# Altium project Aux_SteeringWheel_V8.PrjPcb
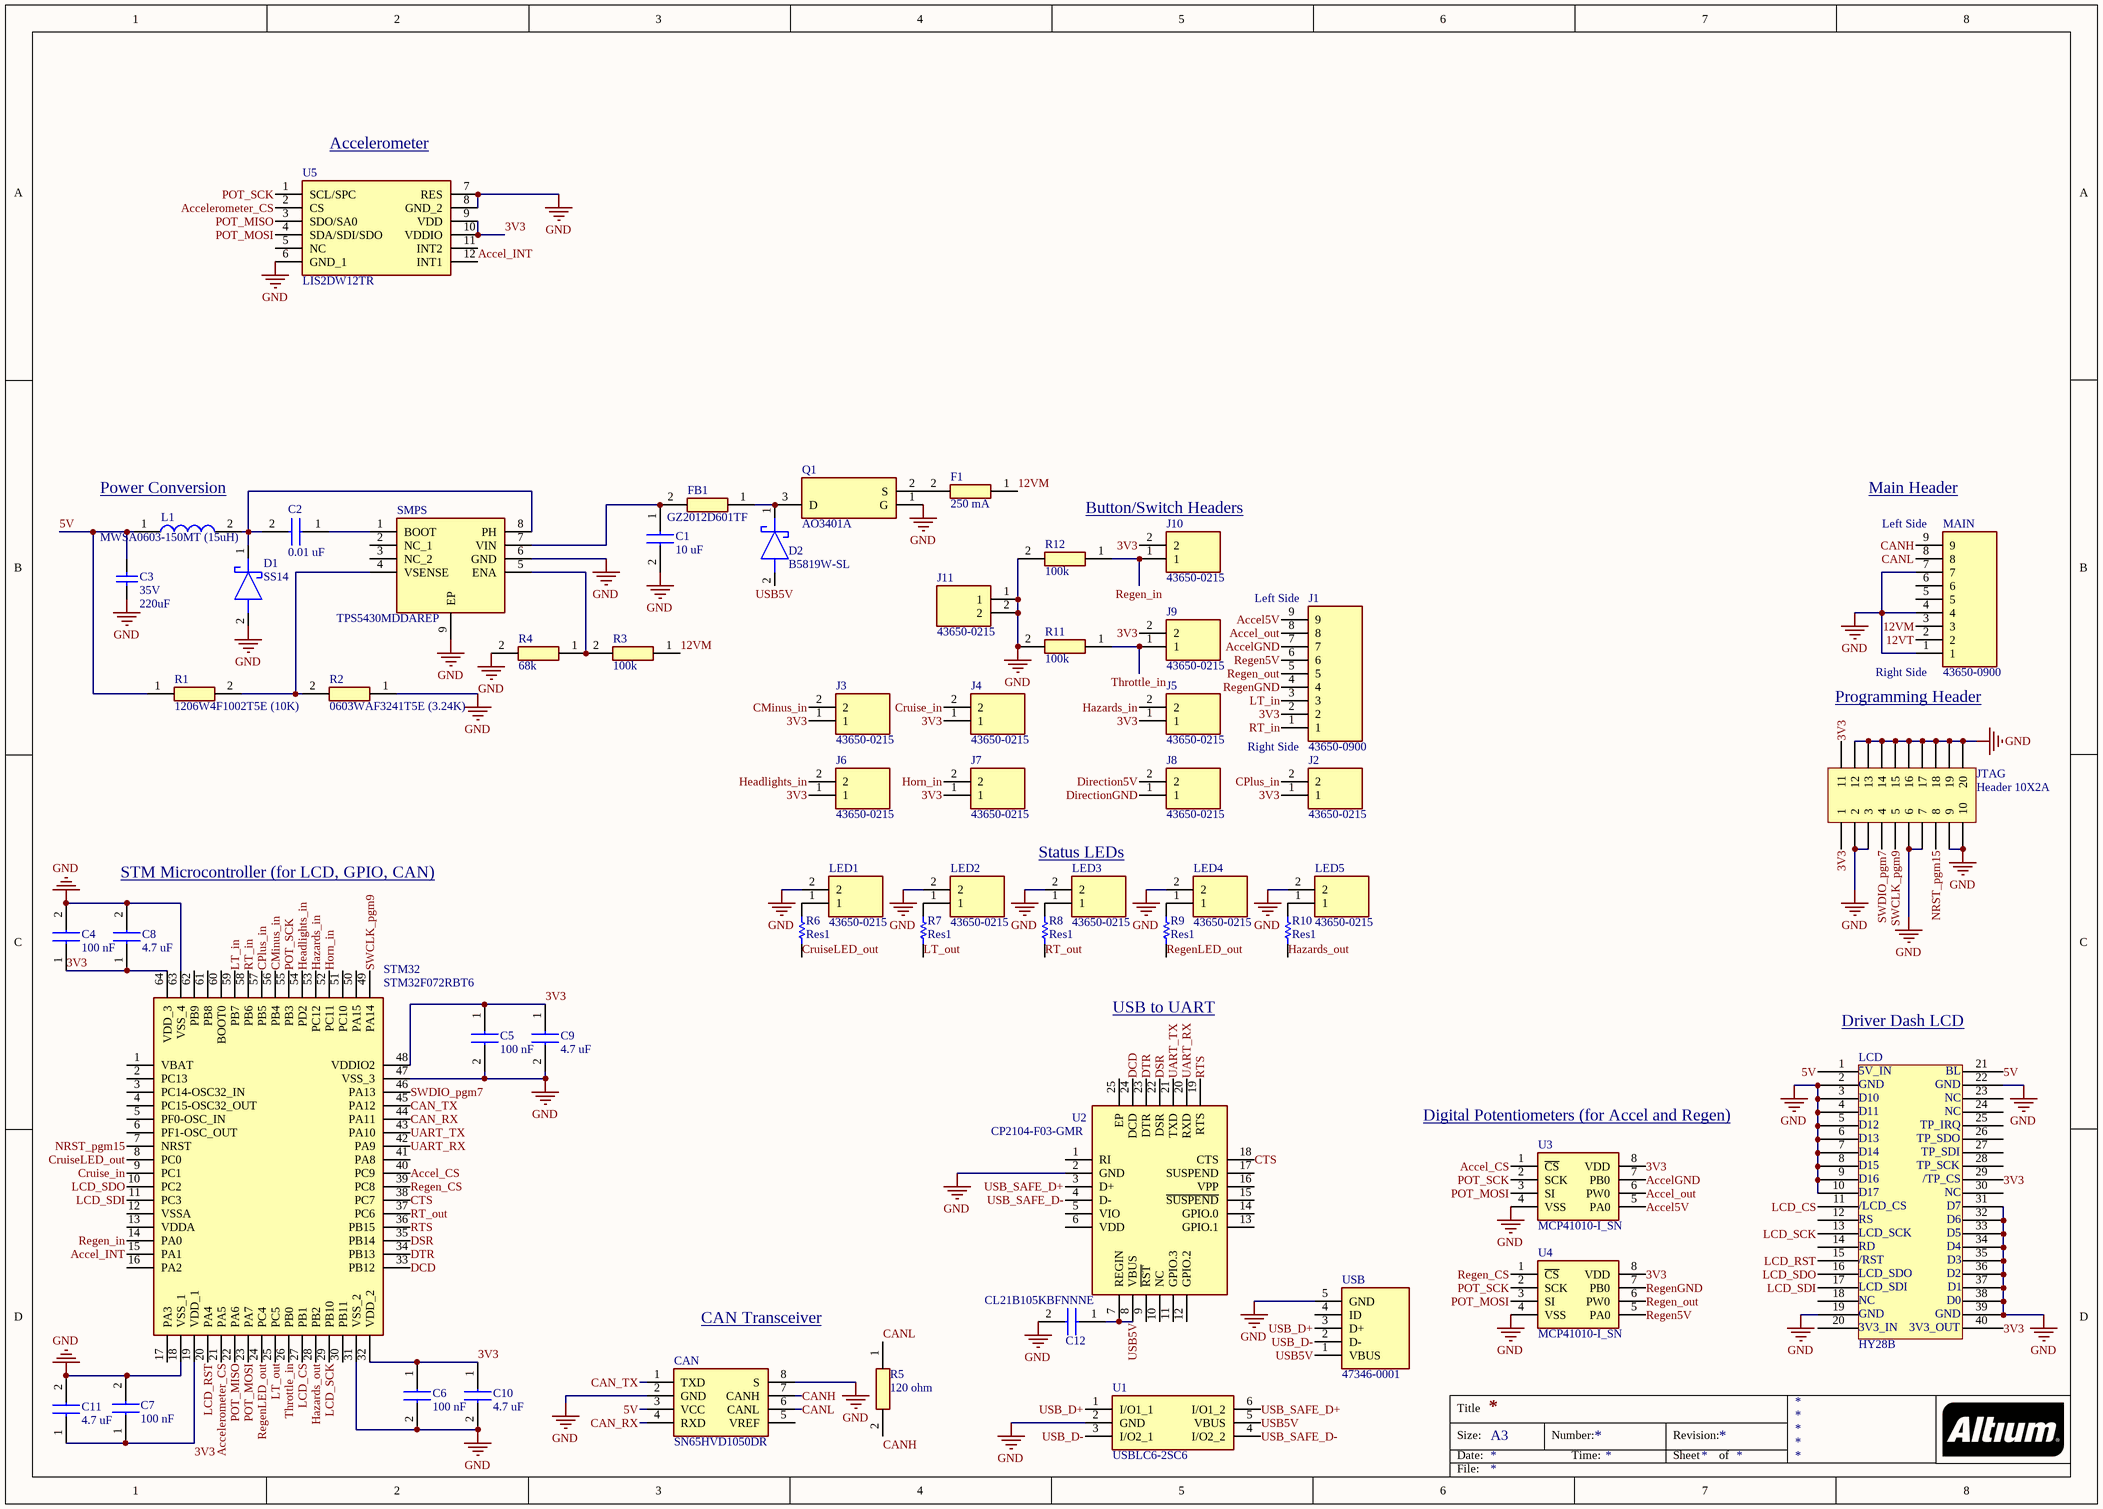
[diagram p0: Sheet4.SchDoc]
1 sheet, 58 parts. Net scope: global (net labels, ports and power ports of the same name join across sheets).
Board file: PCB1.PcbDoc

## Sheet Sheet4.SchDoc
size A3

### Parts
C1  10 uF  [CAPC2012X145N]
C2  0.01 uF  [CAPC2012X65N]
C3  35V  value 220uF  [RAD-0.3]
C4  100 nF  [CAPC1005X55N]
C5  100 nF  [CAPC1005X55N]
C6  100 nF  [CAPC1005X55N]
C7  100 nF  [CAPC1005X55N]
C8  4.7 uF  [CAPC2012X140N]
C9  4.7 uF  [CAPC2012X140N]
C10  4.7 uF  [CAPC2012X140N]
C11  4.7 uF  [CAPC2012X140N]
C12  CL21B105KBFNNNE  [CAPC2012X135N]
CAN  SN65HVD1050DR  [SOIC127P600X175-8N]
D1  SS14  [DIONM5327X242N]
D2  B5819W-SL  [SOD3716X135N]
F1  250 mA  [RESC3216X51N]
FB1  GZ2012D601TF  [RESC2012X55N]
J1  43650-0900  [436500900]
J2  43650-0215  [43650-0217]
J3  43650-0215  [43650-0217]
J4  43650-0215  [43650-0217]
J5  43650-0215  [43650-0217]
J6  43650-0215  [43650-0217]
J7  43650-0215  [43650-0217]
J8  43650-0215  [43650-0217]
J9  43650-0215  [43650-0217]
J10  43650-0215  [43650-0217]
J11  43650-0215  [43650-0217]
JTAG  Header 10X2A  [HDR2X10_CEN]
L1  MWSA0603-150MT (15uH)  [INDPM7166X300N]
LCD  HY28B  [HY28B]
LED1  43650-0215  [43650-0217]
LED2  43650-0215  [43650-0217]
LED3  43650-0215  [43650-0217]
LED4  43650-0215  [43650-0217]
LED5  43650-0215  [43650-0217]
MAIN  43650-0900  [436500900]
Q1  AO3401A  [SOT95P237X115-3N]
R1  1206W4F1002T5E (10K)  [RESC3216X75N]
R2  0603WAF3241T5E (3.24K)  [RESC1608X55N]
R3  100k  [RESC3216X51N]
R4  68k  [RESC1608X55N]
R5  120 ohm  [RESC1608X55N]
R6  Res1  [AXIAL-0.3]
R7  Res1  [AXIAL-0.3]
R8  Res1  [AXIAL-0.3]
R9  Res1  [AXIAL-0.3]
R10  Res1  [AXIAL-0.3]
R11  100k  [RESC3216X51N]
R12  100k  [RESC3216X51N]
SMPS  TPS5430MDDAREP  [SOIC127P600X170-9N]
STM32  STM32F072RBT6  [QFP50P1200X1200X160-64N]
U1  USBLC6-2SC6  [SOT95P280X145-6N]
U2  CP2104-F03-GMR  [QFN50P400X400X80-25N-D]
U3  MCP41010-I_SN  [SOIC127P600X175-8N]
U4  MCP41010-I_SN  [SOIC127P600X175-8N]
U5  LIS2DW12TR  [LGA-12]
USB  47346-0001  [47346-0001]

### Nets
GND: C1.2 C3.1 C4.2 C5.2 C6.2 C7.2 C8.2 C9.2 C10.2 C11.2 C12.2 CAN.2(GND) CAN.8(S) D1.2(A) J11.1 J11.2 JTAG.2 JTAG.3 JTAG.6 JTAG.7 JTAG.9 JTAG.10 JTAG.12 JTAG.13 JTAG.14 JTAG.15 JTAG.16 JTAG.17 JTAG.18 JTAG.19 JTAG.20 LCD.2 LCD.3 LCD.4 LCD.5 LCD.6 LCD.7 LCD.8 LCD.9 LCD.10 LCD.19 LCD.22 LCD.31 LCD.32 LCD.33 LCD.34 LCD.35 LCD.36 LCD.37 LCD.38 LCD.39 LED1.2 LED2.2 LED3.2 LED4.2 LED5.2 MAIN.1 MAIN.4 MAIN.7 Q1.1(G) R2.1 R4.2 R11.2 R12.2 SMPS.6(GND) SMPS.9(EP) STM32.18(VSS_1) STM32.31(VSS_2) STM32.47(VSS_3) STM32.63(VSS_4) U1.2(GND) U2.2(GND) U3.4(VSS) U4.4(VSS) U5.6(GND_1) U5.7(RES) U5.8(GND_2) USB.5(GND)
3V3: C4.1 C5.1 C6.1 C7.1 C8.1 C9.1 C10.1 C11.1 J1.2 J2.1 J3.1 J4.1 J5.1 J6.1 J7.1 J9.2 J10.2 JTAG.1 JTAG.11 LCD.29 LCD.40 STM32.19(VDD_1) STM32.32(VDD_2) STM32.48(VDDIO2) STM32.64(VDD_3) U3.8(VDD) U4.8(VDD) U5.9(VDD) U5.10(VDDIO)
5V: C3.2 CAN.3(VCC) L1.1 LCD.1 LCD.21 R1.1
12VM: F1.1 MAIN.3 R3.1
12VT: MAIN.2
Accel5V: J1.9 U3.5(PA0)
Accel_CS: STM32.40(PC9) U3.1(~{CS})
Accel_INT: STM32.15(PA1) U5.12(INT1)
Accel_out: J1.8 U3.6(PW0)
Accelerometer_CS: STM32.21(PA5) U5.2(CS)
AccelGND: J1.7 U3.7(PB0)
CAN_RX: CAN.4(RXD) STM32.44(PA11)
CAN_TX: CAN.1(TXD) STM32.45(PA12)
CANH: CAN.7(CANH) MAIN.9 R5.2
CANL: CAN.6(CANL) MAIN.8 R5.1
CMinus_in: J3.2 STM32.56(PB4)
CPlus_in: J2.2 STM32.57(PB5)
Cruise_in: J4.2 STM32.9(PC1)
CruiseLED_out: R6.1 STM32.8(PC0)
CTS: STM32.38(PC7) U2.18(CTS)
DCD: STM32.33(PB12) U2.24(DCD)
Direction5V: J8.2
DirectionGND: J8.1
DSR: STM32.35(PB14) U2.22(DSR)
DTR: STM32.34(PB13) U2.23(DTR)
Hazards_in: J5.2 STM32.53(PC12)
Hazards_out: R10.1 STM32.28(PB2)
Headlights_in: J6.2 STM32.54(PD2)
Horn_in: J7.2 STM32.52(PC11)
LCD_CS: LCD.11 STM32.27(PB1)
LCD_RST: LCD.15 STM32.20(PA4)
LCD_SCK: LCD.13 STM32.29(PB10)
LCD_SDI: LCD.17 STM32.11(PC3)
LCD_SDO: LCD.16 STM32.10(PC2)
LT_in: J1.3 STM32.59(PB7)
LT_out: R7.1 STM32.25(PC5)
NRST_pgm15: JTAG.8 STM32.7(NRST)
POT_MISO: STM32.22(PA6) U5.3(SDO/SA0)
POT_MOSI: STM32.23(PA7) U3.3(SI) U4.3(SI) U5.4(SDA/SDI/SDO)
POT_SCK: STM32.55(PB3) U3.2(SCK) U4.2(SCK) U5.1(SCL/SPC)
Regen5V: J1.6 U4.5(PA0)
Regen_CS: STM32.39(PC8) U4.1(~{CS})
Regen_in: J10.1 R12.1 STM32.14(PA0)
Regen_out: J1.5 U4.6(PW0)
RegenGND: J1.4 U4.7(PB0)
RegenLED_out: R9.1 STM32.24(PC4)
RT_in: J1.1 STM32.58(PB6)
RT_out: R8.1 STM32.37(PC6)
RTS: STM32.36(PB15) U2.19(RTS)
SWCLK_pgm9: JTAG.5 STM32.49(PA14)
SWDIO_pgm7: JTAG.4 STM32.46(PA13)
Throttle_in: J9.1 R11.1 STM32.26(PB0)
UART_RX: STM32.42(PA9) U2.20(RXD)
UART_TX: STM32.43(PA10) U2.21(TXD)
USB5V: C12.1 D2.2(A) U1.5(VBUS) U2.7(REGIN) U2.8(VBUS) USB.1(VBUS)
USB_D+: U1.1(I/O1_1) USB.3(D+)
USB_D-: U1.3(I/O2_1) USB.2(D-)
USB_SAFE_D+: U1.6(I/O1_2) U2.3(D+)
USB_SAFE_D-: U1.4(I/O2_2) U2.4(D-)
NetC1_1: C1.1 FB1.2 SMPS.7(VIN)
NetC2_1: C2.1 SMPS.1(BOOT)
NetC2_2: C2.2 D1.1(K) L1.2 SMPS.8(PH)
NetD2_1: D2.1(K) FB1.1 Q1.3(D)
NetF1_2: F1.2 Q1.2(S)
NetLED1_1: LED1.1 R6.2
NetLED2_1: LED2.1 R7.2
NetLED3_1: LED3.1 R8.2
NetLED4_1: LED4.1 R9.2
NetLED5_1: LED5.1 R10.2
NetR1_2: R1.2 R2.2 SMPS.4(VSENSE)
NetR3_2: R3.2 R4.1 SMPS.5(ENA)

Not connected (* = marked no-connect by the designer): CAN 5(VREF); LCD 12 14 18 20 23 24 25 26 27 28 30; MAIN 5 6; SMPS 2(NC_1) 3(NC_2); STM32 1(VBAT) 2(PC13) 3(PC14-OSC32_IN) 4(PC15-OSC32_OUT) 5(PF0-OSC_IN) 6(PF1-OSC_OUT) 12(VSSA) 13(VDDA) 16(PA2) 17(PA3) 30(PB11) 41(PA8) 50(PA15) 51(PC10) 60(BOOT0) 61(PB8) 62(PB9); U2 1(RI) 5(VIO) 6(VDD) 9(~{RST}) 10(NC) 11(GPIO.3) 12(GPIO.2) 13(GPIO.1) 14(GPIO.0) 15(~{SUSPEND}) 16(VPP) 17(SUSPEND) 25(EP); U5 5(NC) 11(INT2); USB 4(ID)

### Notes on the sheet
- (near U5) Accelerometer
- (near L1) Power Conversion
- Button/Switch Headers
- (near MAIN) Main Header
- (near MAIN) Left Side
- (near J1) Left Side
- (near MAIN) Programming Header
- (near MAIN) Right Side
- (near J1) Right Side
- (near LED3) Status LEDs
- STM Microcontroller (for LCD, GPIO, CAN)
- USB to UART
- (near LCD) Driver Dash LCD
- Digital Potentiometers (for Accel and Regen)
- CAN Transceiver
- Title
- Size:
- Date:
- A3
- Number:
- Time:
- Revision:
- Sheet
- of
- File:
- (in symbol HY28B) 5V_IN; BL; GND; D10; NC; D11; D12; TP_IRQ; D13; TP_SDO; D14; TP_SDI; D15; TP_SCK; D16; /TP_CS; D17; /LCD_CS; D7; RS; D6; LCD_SCK; D5; RD; D4; /RST; D3; LCD_SDO; D2; LCD_SDI; D1; D0; 3V3_IN; 3V3_OUT

### Library data of the parts
C1 = CL21A106KAYNNNE: Capacitor; Manufacturer_Name: Samsung Electro-Mechanics; Datasheet Link: https://datasheet.datasheetarchive.com/originals/distributors/Datasheets_SAMA/6a45835c9b7400e9b49c55c38a8ff4a2.pdf; Height: 1.45mm; Manufacturer_Part_Number: CL21A106KAYNNNE
C2 = CL21B103KBANNNC: Capacitor; Manufacturer_Name: Samsung Electro-Mechanics; Datasheet Link: https://datasheet.datasheetarchive.com/originals/distributors/Datasheets_SAMA/97c54fb7f716f6f5bd35dfc2c9b17795.pdf; Height: 0.65mm; Manufacturer_Part_Number: CL21B103KBANNNC
C3 = Cap: Capacitor; Published: 8-Jun-2000; LatestRevisionDate: 17-Jul-2002; LatestRevisionNote: Re-released for DXP Platform.; PackageReference: RAD-0.3; Publisher: Altium Limited; PackageDescription: Radial Cap, Thru-Hole; 2 Leads; 0.3 in Pin Spacing
C4-C7 = CL05B104KO5NNNC: Capacitor; Manufacturer_Name: Samsung Electro-Mechanics; Datasheet Link: https://datasheet.datasheetarchive.com/originals/distributors/Datasheets-DGA10/2408147.pdf; Height: 0.55mm; Mouser2 Part Number: N/A; Mouser2 Price/Stock: https://www.mouser.com/Search/Refine.aspx?Keyword=N%2FA; Manufacturer_Part_Number: CL05B104KO5NNNC
C8-C11 = CL21A475KAQNNNE: Capacitor; Manufacturer_Name: Samsung Electro-Mechanics; Datasheet Link: https://datasheet.datasheetarchive.com/originals/distributors/Datasheets_SAMA/7c2e9fae61a8ce6685f6522ddec12c79.pdf; Height: 1.4mm; Manufacturer_Part_Number: CL21A475KAQNNNE
C12 = CL21B105KBFNNNE: Capacitor; Manufacturer_Name: Samsung Electro-Mechanics; Datasheet Link: https://componentsearchengine.com/Datasheets/2/CL21B105KBFNNNE.pdf; Height: 1.35mm; Manufacturer_Part_Number: CL21B105KBFNNNE
CAN = SN65HVD1050DR: Integrated Circuit; Manufacturer_Name: Texas Instruments; Datasheet Link: https://www.ti.com/lit/ds/symlink/sn65hvd1050.pdf?ts=1618896978538&ref_url=https%253A%252F%252Fwww.google.com%252F; Height: 1.75mm; Manufacturer_Part_Number: SN65HVD1050DR
D1 = SS14: Schottky Diode; Manufacturer_Name: MDD(Microdiode Electronics); Datasheet Link: https://datasheet.lcsc.com/szlcsc/1903051003_MDD-Jiangsu-Yutai-Elec-SS14_C2480.pdf; Height: 2.42mm; Manufacturer_Part_Number: SS14
D2 = B5819W-TP: Schottky Diode; Manufacturer_Name: Micro Commercial Components (MCC); Datasheet Link: https://www.mccsemi.com/pdf/Products/B5817W-B5819W(SOD-123).pdf; Height: 1.35mm; Manufacturer_Part_Number: B5819W-TP
F1 R3 R11 R12 = PHPA1206E2001BST1: Resistor; Manufacturer_Name: Vishay; Datasheet Link: https://www.vishay.com/docs/60160/phpa.pdf; Height: 0.508mm; Manufacturer_Part_Number: PHPA1206E2001BST1
FB1 = TNPU080550K0AZEN00: Resistor; Manufacturer_Name: Vishay; Datasheet Link: https://www.mouser.in/datasheet/2/427/tnpue3-1762586.pdf; Height: 0.55mm; Manufacturer_Part_Number: TNPU080550K0AZEN00
J1 MAIN = 43650-0900: Connector; Manufacturer_Name: Molex; Datasheet Link: https://www.molex.com/pdm_docs/sd/436500900_sd.pdf; Height: 5.57mm; Manufacturer_Part_Number: 43650-0900
J2-J11 LED1-LED5 = 43650-0215: Connector; Manufacturer_Name: Molex; Datasheet Link: https://componentsearchengine.com//43650-0215.pdf; Mouser2 Part Number: 538-43650-0215; Mouser2 Price/Stock: https://www.mouser.com/Search/Refine.aspx?Keyword=538-43650-0215; Manufacturer_Part_Number: 43650-0215
JTAG = Header 10X2A: Header, 10-Pin, Dual row; LatestRevisionDate: 17-Jul-2002; LatestRevisionNote: Re-released for DXP Platform.; Publisher: Altium Limited
L1 = SRP7028AA-220M: Inductor; Manufacturer_Name: Bourns; Datasheet Link: https://www.bourns.com/docs/Product-Datasheets/SRP7028AA.pdf; Height: 3mm; Manufacturer_Part_Number: SRP7028AA-220M
LCD = HY28B: 2.8" LCD
Q1 = AQ3102-02HTG: Diode ESD (Bi-directional); Manufacturer_Name: LITTELFUSE; Datasheet Link: https://componentsearchengine.com/Datasheets/2/AQ3102-02HTG.pdf; Height: 1.15mm; Manufacturer_Part_Number: AQ3102-02HTG
R1 = CR1206-FW-2214ELF: Resistor; Manufacturer_Name: Bourns; Height: 0.75mm; Manufacturer_Part_Number: CR1206-FW-2214ELF
R2 R4 R5 = MCT0603MZ0000ZP500: Resistor; Manufacturer_Name: Vishay; Datasheet Link: http://www.vishay.com/docs/28705/mcx0x0xpro.pdf; Height: 0.55mm; Manufacturer_Part_Number: MCT0603MZ0000ZP500
R6-R10 = Res1: Resistor; Value: ??; Published: 8-Jun-2000; LatestRevisionDate: 17-Jul-2002; LatestRevisionNote: Re-released for DXP Platform.; PackageReference: AXIAL-0.3; Publisher: Altium Limited; PackageDescription: Axial Device, Thru-Hole; 2 Leads; 0.3 in Pin Spacing
SMPS = TPS5430MDDAREP: Integrated Circuit; Manufacturer_Name: Texas Instruments; Datasheet Link: http://www.ti.com/lit/gpn/tps5430-ep; Height: 1.7mm; Mouser2 Part Number: 595-TPS5430MDDAREP; Mouser2 Price/Stock: https://www.mouser.com/Search/Refine.aspx?Keyword=595-TPS5430MDDAREP; Manufacturer_Part_Number: TPS5430MDDAREP
STM32 = STM32F072RBT6: Integrated Circuit; Manufacturer_Name: STMicroelectronics; Datasheet Link: https://componentsearchengine.com//STM32F072RBT6.pdf; Height: 1.6mm; Mouser2 Part Number: 511-STM32F072RBT6; Mouser2 Price/Stock: https://www.mouser.com/Search/Refine.aspx?Keyword=511-STM32F072RBT6; Manufacturer_Part_Number: STM32F072RBT6
U1 = USBLC6-2SC6: Integrated Circuit; Manufacturer_Name: STMicroelectronics; Datasheet Link: https://componentsearchengine.com//USBLC6-2SC6.pdf; Height: 1.45mm; Mouser2 Part Number: 511-USBLC6-2SC6; Mouser2 Price/Stock: https://www.mouser.com/Search/Refine.aspx?Keyword=511-USBLC6-2SC6; Manufacturer_Part_Number: USBLC6-2SC6
U2 = CP2104-F03-GMR: Integrated Circuit; Manufacturer_Name: Silicon Labs; Datasheet Link: https://componentsearchengine.com//CP2104-F03-GMR.pdf; Height: 0.8mm; Mouser2 Part Number: 634-CP2104-F03-GMR; Mouser2 Price/Stock: https://www.mouser.com/Search/Refine.aspx?Keyword=634-CP2104-F03-GMR; Manufacturer_Part_Number: CP2104-F03-GMR
U3 U4 = MCP41010-I_SN: Integrated Circuit; Manufacturer_Name: Microchip; Manufacturer_Part_Number: MCP41010-I/SN; Datasheet Link: https://componentsearchengine.com//MCP41010-I_SN.pdf; Height: 1.75mm; Mouser2 Part Number: 579-MCP41010-I/SN; Mouser2 Price/Stock: https://www.mouser.com/Search/Refine.aspx?Keyword=579-MCP41010-I%2FSN
U5 = LIS2DW12TR: Integrated Circuit; Manufacturer_Name: STMicroelectronics; Datasheet Link: https://componentsearchengine.com//LIS2DW12TR.pdf; Mouser2 Part Number: 511-LIS2DW12TR; Mouser2 Price/Stock: https://www.mouser.com/Search/Refine.aspx?Keyword=511-LIS2DW12TR; Manufacturer_Part_Number: LIS2DW12TR
USB = 47346-0001: Connector; Manufacturer_Name: Molex; Datasheet Link: http://www.molex.com/pdm_docs/sd/473460001_sd.pdf; Manufacturer_Part_Number: 47346-0001